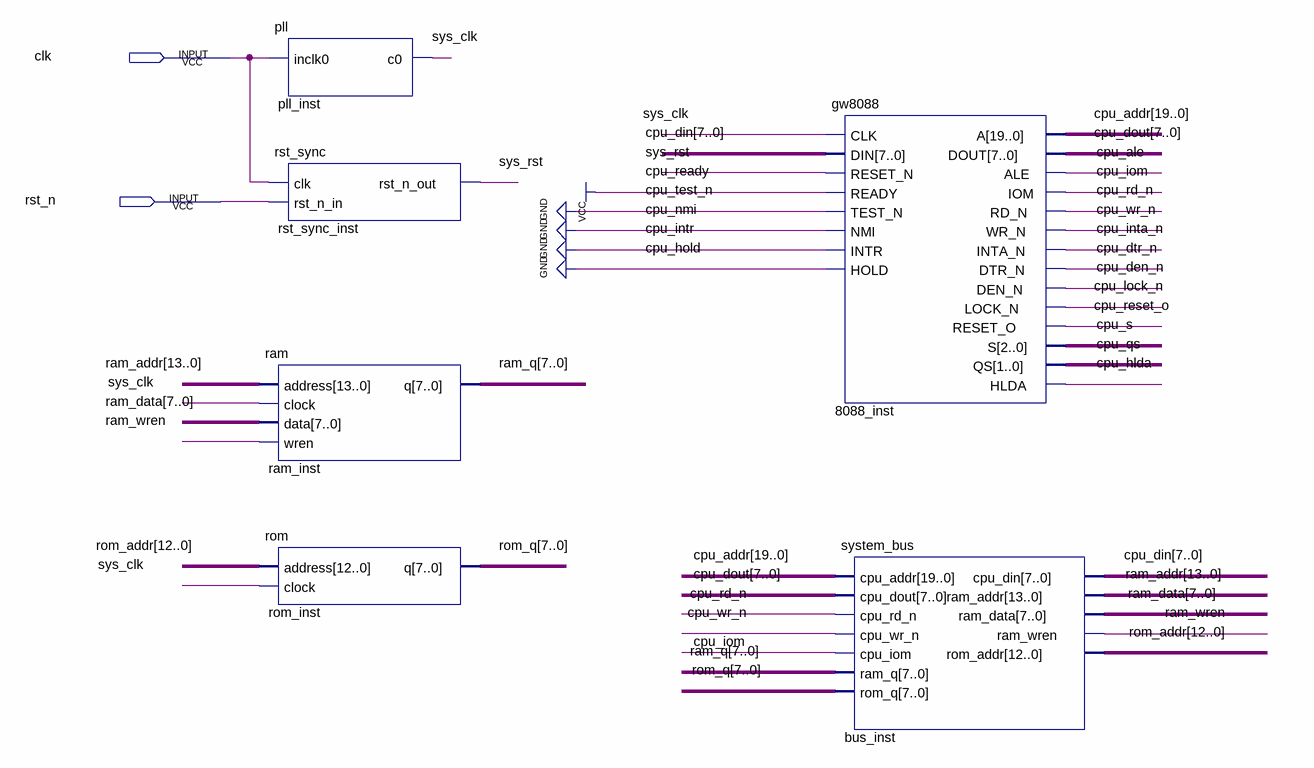
[diagram p0: schematic sheet]
// Quartus schematic mpe.bdf as structural Verilog: 6 symbols, 2 pins
module mpe (
  input  clk,
  input  rst_n
);

  wire cpu_ale, cpu_den_n, cpu_dtr_n, cpu_hlda, cpu_inta_n, cpu_iom, cpu_lock_n, cpu_qs, cpu_rd_n,
       cpu_reset_o, cpu_s, cpu_wr_n, ram_wren, sys_clk, sys_rst;
  wire [7:0] cpu_din, cpu_dout, ram_data, ram_q, rom_q;
  wire [12:0] rom_addr;
  wire [13:0] ram_addr;
  wire [19:0] cpu_addr;

  pll pll_inst (.inclk0(clk), .c0(sys_clk));
  rst_sync rst_sync_inst (.clk(clk), .rst_n_in(rst_n), .rst_n_out(sys_rst));
  ram ram_inst (.address(ram_addr), .clock(sys_clk), .data(ram_data), .wren(ram_wren), .q(ram_q));
  rom rom_inst (.address(rom_addr), .clock(sys_clk), .q(rom_q));
  gw8088 u_8088_inst (
    .CLK(sys_clk), .DIN(cpu_din), .RESET_N(sys_rst), .READY(1'b1), .TEST_N(1'b0), .NMI(1'b0), .INTR(1'b0),
    .HOLD(1'b0), .A(cpu_addr), .DOUT(cpu_dout), .ALE(cpu_ale), .IOM(cpu_iom), .RD_N(cpu_rd_n),
    .WR_N(cpu_wr_n), .INTA_N(cpu_inta_n), .DTR_N(cpu_dtr_n), .DEN_N(cpu_den_n), .LOCK_N(cpu_lock_n),
    .RESET_O(cpu_reset_o), .S(cpu_s), .QS(cpu_qs), .HLDA(cpu_hlda));
  system_bus bus_inst (
    .cpu_addr(cpu_addr), .cpu_dout(cpu_dout), .cpu_rd_n(cpu_rd_n), .cpu_wr_n(cpu_wr_n), .cpu_iom(cpu_iom),
    .ram_q(ram_q), .rom_q(rom_q), .cpu_din(cpu_din), .ram_addr(ram_addr), .ram_data(ram_data),
    .ram_wren(ram_wren), .rom_addr(rom_addr));
endmodule
